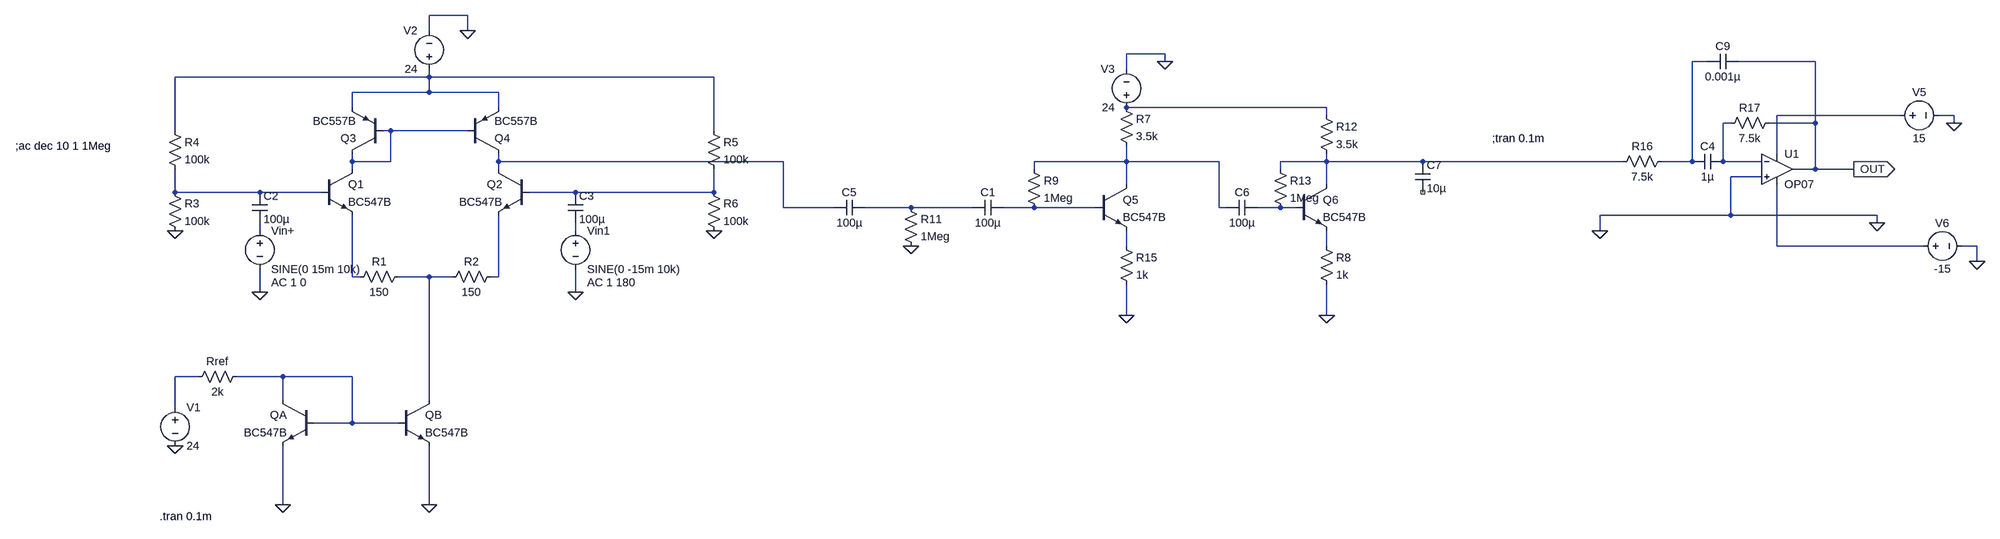
[diagram p0: schematic BJT_Diff_amp_Gain_DE_4_diff_in.asc]
BJT_Diff_amp_Gain_DE_4_diff_in.asc, the LTspice schematic file:
Version 4
SHEET 1 3572 1044
WIRE 240 -240 160 -240
WIRE 160 -208 160 -240
WIRE 240 -208 240 -240
WIRE 1776 -160 1696 -160
WIRE 1776 -144 1776 -160
WIRE 2992 -144 2960 -144
WIRE 3216 -144 3056 -144
WIRE 1696 -128 1696 -160
WIRE 160 -112 160 -128
WIRE 160 -112 -368 -112
WIRE 752 -112 160 -112
WIRE 160 -80 160 -112
WIRE 160 -80 0 -80
WIRE 304 -80 160 -80
WIRE 0 -48 0 -80
WIRE 304 -48 304 -80
WIRE 2112 -48 1696 -48
WIRE 2112 -32 2112 -48
WIRE 3392 -32 3136 -32
WIRE 3504 -32 3472 -32
WIRE 3040 -16 3024 -16
WIRE 3216 -16 3216 -144
WIRE 3216 -16 3120 -16
WIRE 3504 -16 3504 -32
WIRE -368 0 -368 -112
WIRE 80 0 64 0
WIRE 240 0 80 0
WIRE 752 0 752 -112
WIRE 3136 48 3136 -32
WIRE 0 64 0 48
WIRE 80 64 80 0
WIRE 80 64 0 64
WIRE 304 64 304 48
WIRE 896 64 304 64
WIRE 1696 64 1696 32
WIRE 1696 64 1504 64
WIRE 1888 64 1696 64
WIRE 2112 64 2112 48
WIRE 2112 64 2016 64
WIRE 2400 64 2112 64
WIRE 2816 64 2400 64
WIRE 2960 64 2960 -144
WIRE 2960 64 2896 64
WIRE 3024 64 3024 -16
WIRE 3104 64 3024 64
WIRE 0 80 0 64
WIRE 304 80 304 64
WIRE 1504 80 1504 64
WIRE 2016 80 2016 64
WIRE 3216 80 3216 -16
WIRE 3216 80 3168 80
WIRE 3296 80 3216 80
WIRE 3104 96 3040 96
WIRE 1696 112 1696 64
WIRE 2112 112 2112 64
WIRE -368 128 -368 80
WIRE -192 128 -368 128
WIRE -64 128 -192 128
WIRE 464 128 368 128
WIRE 752 128 752 80
WIRE 752 128 464 128
WIRE 896 160 896 64
WIRE 1088 160 896 160
WIRE 1248 160 1152 160
WIRE 1376 160 1248 160
WIRE 1504 160 1440 160
WIRE 1632 160 1504 160
WIRE 1888 160 1888 64
WIRE 1904 160 1888 160
WIRE 2016 160 1968 160
WIRE 2048 160 2016 160
WIRE 3040 176 3040 96
WIRE 3040 176 2768 176
WIRE 3344 176 3040 176
WIRE 3344 192 3344 176
WIRE -192 208 -192 192
WIRE 464 208 464 192
WIRE 2768 208 2768 176
WIRE 1696 240 1696 208
WIRE 2112 240 2112 208
WIRE 3136 240 3136 112
WIRE 3440 240 3136 240
WIRE 3552 240 3520 240
WIRE 3552 272 3552 240
WIRE 0 304 0 176
WIRE 16 304 0 304
WIRE 160 304 96 304
WIRE 208 304 160 304
WIRE 304 304 304 176
WIRE 304 304 288 304
WIRE -192 336 -192 288
WIRE 464 336 464 288
WIRE 1696 384 1696 320
WIRE 2112 384 2112 320
WIRE -320 512 -368 512
WIRE -144 512 -240 512
WIRE 0 512 -144 512
WIRE -144 560 -144 512
WIRE 160 560 160 304
WIRE -368 576 -368 512
WIRE 0 608 0 512
WIRE 0 608 -80 608
WIRE 96 608 0 608
WIRE -144 880 -144 656
WIRE 160 880 160 656
FLAG -192 336 0
FLAG 240 -208 0
FLAG -144 880 0
FLAG 160 880 0
FLAG -368 656 0
FLAG -368 208 0
FLAG 752 208 0
FLAG 1696 384 0
FLAG 1776 -144 0
FLAG 1248 240 0
FLAG 2112 384 0
FLAG 464 336 0
FLAG 2768 208 0
FLAG 3296 80 OUT
IOPIN 3296 80 Out
FLAG 3344 192 0
FLAG 3504 -16 0
FLAG 3552 272 0
SYMBOL npn 368 80 M0
SYMATTR InstName Q2
SYMATTR Value BC547B
SYMBOL npn -64 80 R0
SYMATTR InstName Q1
SYMATTR Value BC547B
SYMBOL res 112 288 R90
WINDOW 0 0 56 VBottom 2
WINDOW 3 32 56 VTop 2
SYMATTR InstName R1
SYMATTR Value 150
SYMBOL res 304 288 R90
WINDOW 0 0 56 VBottom 2
WINDOW 3 32 56 VTop 2
SYMATTR InstName R2
SYMATTR Value 150
SYMBOL npn 96 560 R0
SYMATTR InstName QB
SYMATTR Value BC547B
SYMBOL npn -80 560 M0
SYMATTR InstName QA
SYMATTR Value BC547B
SYMBOL res -224 496 R90
WINDOW 0 0 56 VBottom 2
WINDOW 3 32 56 VTop 2
SYMATTR InstName Rref
SYMATTR Value 2k
SYMBOL voltage 160 -112 R180
WINDOW 0 24 96 Left 2
WINDOW 3 24 16 Left 2
WINDOW 123 0 0 Left 0
WINDOW 39 0 0 Left 0
SYMATTR InstName V2
SYMATTR Value 24
SYMBOL voltage -192 192 R0
WINDOW 123 24 124 Left 2
WINDOW 39 0 0 Left 0
SYMATTR Value2 AC 1 0
SYMATTR InstName Vin+
SYMATTR Value SINE(0 15m 10k)
SYMBOL pnp 64 48 R180
SYMATTR InstName Q3
SYMATTR Value BC557B
SYMBOL pnp 240 48 M180
SYMATTR InstName Q4
SYMATTR Value BC557B
SYMBOL voltage -368 560 R0
WINDOW 123 0 0 Left 0
WINDOW 39 0 0 Left 0
SYMATTR InstName V1
SYMATTR Value 24
SYMBOL cap -208 128 R0
SYMATTR InstName C2
SYMATTR Value 100µ
SYMBOL res -384 112 R0
SYMATTR InstName R3
SYMATTR Value 100k
SYMBOL res -384 -16 R0
SYMATTR InstName R4
SYMATTR Value 100k
SYMBOL res 736 -16 R0
SYMATTR InstName R5
SYMATTR Value 100k
SYMBOL res 736 112 R0
SYMATTR InstName R6
SYMATTR Value 100k
SYMBOL npn 1632 112 R0
SYMATTR InstName Q5
SYMATTR Value BC547B
SYMBOL res 1680 -64 R0
SYMATTR InstName R7
SYMATTR Value 3.5k
SYMBOL voltage 1696 -32 R180
WINDOW 0 24 96 Left 2
WINDOW 3 24 16 Left 2
WINDOW 123 0 0 Left 0
WINDOW 39 0 0 Left 0
SYMATTR InstName V3
SYMATTR Value 24
SYMBOL cap 1440 144 R90
WINDOW 0 0 32 VBottom 2
WINDOW 3 32 32 VTop 2
SYMATTR InstName C1
SYMATTR Value 100µ
SYMBOL res 1232 144 R0
SYMATTR InstName R11
SYMATTR Value 1Meg
SYMBOL cap 1152 144 R90
WINDOW 0 0 32 VBottom 2
WINDOW 3 32 32 VTop 2
SYMATTR InstName C5
SYMATTR Value 100µ
SYMBOL npn 2048 112 R0
SYMATTR InstName Q6
SYMATTR Value BC547B
SYMBOL res 2096 224 R0
SYMATTR InstName R8
SYMATTR Value 1k
SYMBOL cap 1968 144 R90
WINDOW 0 0 32 VBottom 2
WINDOW 3 32 32 VTop 2
SYMATTR InstName C6
SYMATTR Value 100µ
SYMBOL res 2096 -48 R0
SYMATTR InstName R12
SYMATTR Value 3.5k
SYMBOL res 1680 224 R0
SYMATTR InstName R15
SYMATTR Value 1k
SYMBOL res 2000 64 R0
SYMATTR InstName R13
SYMATTR Value 1Meg
SYMBOL res 1488 64 R0
SYMATTR InstName R9
SYMATTR Value 1Meg
SYMBOL voltage 464 192 R0
WINDOW 123 24 124 Left 2
WINDOW 39 0 0 Left 0
SYMATTR Value2 AC 1 180
SYMATTR InstName Vin1
SYMATTR Value SINE(0 -15m 10k)
SYMBOL cap 448 128 R0
SYMATTR InstName C3
SYMATTR Value 100µ
SYMBOL cap 3024 48 R90
WINDOW 0 0 32 VBottom 2
WINDOW 3 32 32 VTop 2
SYMATTR InstName C4
SYMATTR Value 1µ
SYMBOL res 2912 48 R90
WINDOW 0 0 56 VBottom 2
WINDOW 3 32 56 VTop 2
SYMATTR InstName R16
SYMATTR Value 7.5k
SYMBOL voltage 3376 -32 R270
WINDOW 0 32 56 VTop 2
WINDOW 3 -32 56 VBottom 2
WINDOW 123 0 0 Left 0
WINDOW 39 0 0 Left 0
SYMATTR InstName V5
SYMATTR Value 15
SYMBOL OpAmps\\OP07 3136 16 R0
SYMATTR InstName U1
SYMBOL res 3136 -32 R90
WINDOW 0 0 56 VBottom 2
WINDOW 3 32 56 VTop 2
SYMATTR InstName R17
SYMATTR Value 7.5k
SYMBOL cap 3056 -160 R90
WINDOW 0 0 32 VBottom 2
WINDOW 3 32 32 VTop 2
SYMATTR InstName C9
SYMATTR Value 0.001µ
SYMBOL voltage 3424 240 R270
WINDOW 0 32 56 VTop 2
WINDOW 3 -32 56 VBottom 2
WINDOW 123 0 0 Left 0
WINDOW 39 0 0 Left 0
SYMATTR InstName V6
SYMATTR Value -15
SYMBOL cap 2384 64 R0
SYMATTR InstName C7
SYMATTR Value 10µ
TEXT -400 904 Left 2 !.tran 0.1m
TEXT -760 32 Left 2 !;ac dec 10 1 1Meg
TEXT 2544 16 Left 2 !;tran 0.1m

The netlist it stands for:
* BJT_Diff_amp_Gain_DE_4_diff_in.asc
Q2 N007 N011 N022 0 BC547B
Q1 N006 N010 N020 0 BC547B
R1 N021 N020 150
R2 N022 N021 150
QB N021 N024 0 0 BC547B
QA N024 N024 0 0 BC547B
Rref N024 N023 2k
V2 N002 0 24
Vin+ N015 0 SINE(0 15m 10k) AC 1 0
Q3 N006 N006 N002 0 BC557B
Q4 N007 N006 N002 0 BC557B
V1 N023 0 24
C2 N010 N015 100µ
R3 N010 0 100k
R4 N002 N010 100k
R5 N002 N011 100k
R6 N011 0 100k
Q5 N008 N013 N017 0 BC547B
R7 N003 N008 3.5k
V3 N003 0 24
C1 N013 N012 100µ
R11 N012 0 1Meg
C5 N012 N007 100µ
Q6 N009 N014 N018 0 BC547B
R8 N018 0 1k
C6 N014 N008 100µ
R12 N003 N009 3.5k
R15 N017 0 1k
R13 N009 N014 1Meg
R9 N008 N013 1Meg
Vin1 N016 0 SINE(0 -15m 10k) AC 1 180
C3 N011 N016 100µ
C4 N005 N001 1µ
R16 N001 N009 7.5k
V5 N004 0 15
XU1 0 N005 N004 N019 OUT LT1001  ; OP07, pins In+ In- V+ V- OUT
R17 OUT N005 7.5k
C9 OUT N001 0.001µ
V6 N019 0 -15
C7 N009 NC_01 10µ
.model NPN NPN
.model PNP PNP
.lib standard.bjt
.tran 0.1m
;ac dec 10 1 1Meg
;tran 0.1m
.lib LTC.lib
.backanno
.end